# Altium schematic sheet expansionBreakout.SchDoc
size A
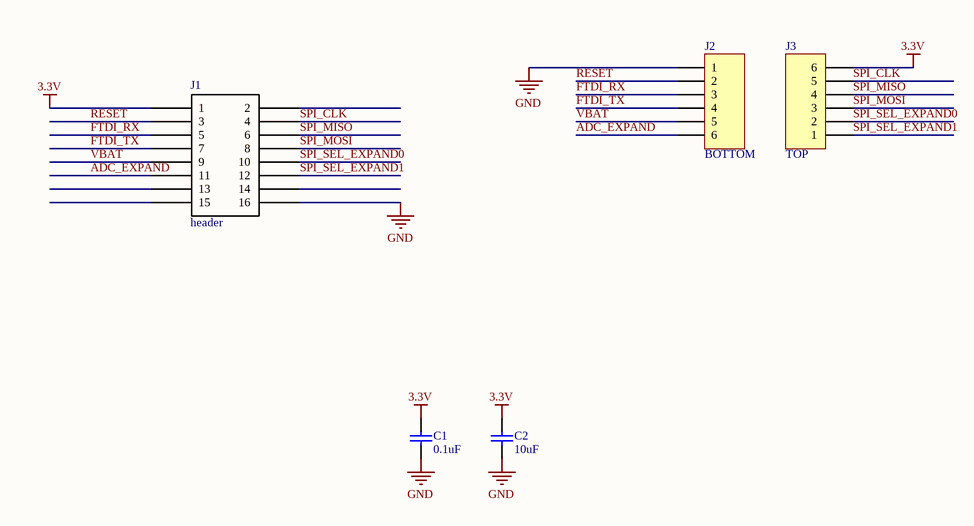
[diagram p0: expansionBreakout.SchDoc]

## Parts
C1  value 0.1uF  [CAPC1005L]
C2  value 10uF  [CAPC1608L]  (hidden comment: Cap Semi)
J1  header  [HEADERSM 8X2]
J2  BOTTOM  [HDR1X6]
J3  TOP  [HDR1X6]

## Nets
3.3V: C1.2 C2.2 J1.1 J3.6
GND: C1.1 C2.1 J1.16 J2.1
ADC_EXPAND: J1.11 J2.6
FTDI_RX: J1.5 J2.3
FTDI_TX: J1.7 J2.4
RESET: J1.3 J2.2
SPI_CLK: J1.4 J3.5
SPI_MISO: J1.6 J3.4
SPI_MOSI: J1.8 J3.3
SPI_SEL_EXPAND0: J1.10 J3.2
SPI_SEL_EXPAND1: J1.12 J3.1
VBAT: J1.9 J2.5

Not connected (* = marked no-connect by the designer): J1 2 13 14 15

## Library data of the parts
C1 = Cap: Capacitor; Published: 8-Jun-2000; LatestRevisionDate: 17-Jul-2002; LatestRevisionNote: Re-released for DXP Platform.; PackageReference: RAD-0.3; Publisher: Altium Limited
C2 = Cap Semi: Capacitor (Semiconductor SIM Model); Published: 8-Jun-2000; LatestRevisionDate: 29-May-2009; LatestRevisionNote: IPC-7351 Footprint Added.; PackageReference: C1206; Publisher: Altium Limited; PackageDescription: Chip Capacitor
J1 = HEADER 8X2
J2 J3 = Header 6: Header, 6-Pin; LatestRevisionDate: 17-Jul-2002; LatestRevisionNote: Re-released for DXP Platform.; Publisher: Altium Limited